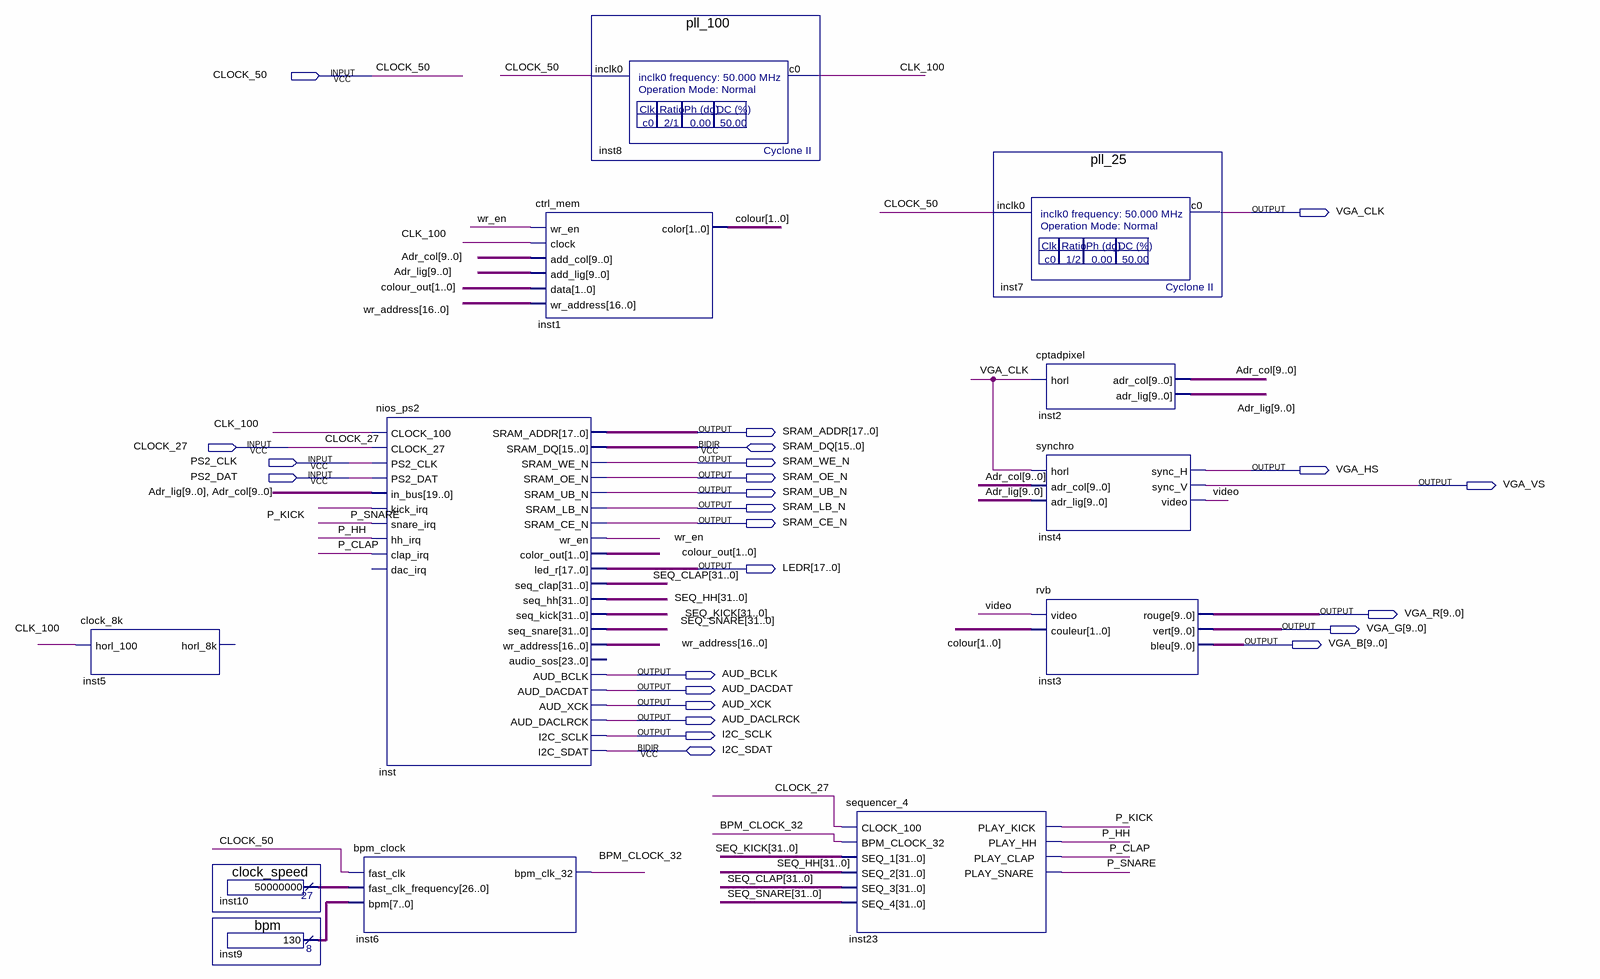
[diagram p0: schematic sheet]
// Quartus schematic main.bdf as structural Verilog: 12 symbols, 24 pins
module main (
  input  CLOCK_50,
  input  CLOCK_27,
  input  PS2_CLK,
  input  PS2_DAT,
  inout  [15:0] SRAM_DQ,
  inout  I2C_SDAT,
  output VGA_CLK,
  output [17:0] SRAM_ADDR,
  output SRAM_WE_N,
  output VGA_HS,
  output SRAM_OE_N,
  output VGA_VS,
  output SRAM_UB_N,
  output SRAM_LB_N,
  output SRAM_CE_N,
  output [17:0] LEDR,
  output [9:0] VGA_R,
  output [9:0] VGA_G,
  output [9:0] VGA_B,
  output AUD_BCLK,
  output AUD_DACDAT,
  output AUD_XCK,
  output AUD_DACLRCK,
  output I2C_SCLK
);

  wire BPM_CLOCK_32, CLK_100, P_CLAP, P_HH, P_KICK, P_SNARE, video, wr_en;
  wire [1:0] colour, colour_out;
  wire [7:0] inst9_result;
  wire [9:0] Adr_col, Adr_lig;
  wire [16:0] wr_address;
  wire [26:0] inst10_result;
  wire [31:0] SEQ_CLAP, SEQ_HH, SEQ_KICK, SEQ_SNARE;

  clock_8k inst5 (.horl_100(CLK_100));  // open: horl_8k
  clock_speed inst10 (.result(inst10_result));
  bpm inst9 (.result(inst9_result));
  nios_ps2 inst (
    .CLOCK_100(CLK_100), .CLOCK_27(CLOCK_27), .PS2_CLK(PS2_CLK), .PS2_DAT(PS2_DAT),
    .in_bus({Adr_lig, Adr_col}), .kick_irq(P_KICK), .snare_irq(P_SNARE), .hh_irq(P_HH), .clap_irq(P_CLAP),
    .SRAM_ADDR(SRAM_ADDR), .SRAM_WE_N(SRAM_WE_N), .SRAM_OE_N(SRAM_OE_N), .SRAM_UB_N(SRAM_UB_N),
    .SRAM_LB_N(SRAM_LB_N), .SRAM_CE_N(SRAM_CE_N), .wr_en(wr_en), .color_out(colour_out), .led_r(LEDR),
    .seq_clap(SEQ_CLAP), .seq_hh(SEQ_HH), .seq_kick(SEQ_KICK), .seq_snare(SEQ_SNARE),
    .wr_address(wr_address), .AUD_BCLK(AUD_BCLK), .AUD_DACDAT(AUD_DACDAT), .AUD_XCK(AUD_XCK),
    .AUD_DACLRCK(AUD_DACLRCK), .I2C_SCLK(I2C_SCLK), .SRAM_DQ(SRAM_DQ), .I2C_SDAT(I2C_SDAT));  // open: dac_irq, audio_sos
  bpm_clock inst6 (
    .fast_clk(CLOCK_50), .fast_clk_frequency(inst10_result), .bpm(inst9_result), .bpm_clk_32(BPM_CLOCK_32));
  ctrl_mem inst1 (
    .wr_en(wr_en), .clock(CLK_100), .add_col(Adr_col), .add_lig(Adr_lig), .data(colour_out),
    .wr_address(wr_address), .color(colour));
  pll_100 inst8 (.inclk0(CLOCK_50), .c0(CLK_100));
  sequencer_4 inst23 (
    .CLOCK_100(CLOCK_27), .BPM_CLOCK_32(BPM_CLOCK_32), .SEQ_1(SEQ_KICK), .SEQ_2(SEQ_HH), .SEQ_3(SEQ_CLAP),
    .SEQ_4(SEQ_SNARE), .PLAY_KICK(P_KICK), .PLAY_HH(P_HH), .PLAY_CLAP(P_CLAP), .PLAY_SNARE(P_SNARE));
  pll_25 inst7 (.inclk0(CLOCK_50), .c0(VGA_CLK));
  cptadpixel inst2 (.horl(VGA_CLK), .adr_col(Adr_col), .adr_lig(Adr_lig));
  synchro inst4 (.horl(VGA_CLK), .adr_col(Adr_col), .adr_lig(Adr_lig), .sync_H(VGA_HS), .sync_V(VGA_VS), .video(video));
  rvb inst3 (.video(video), .couleur(colour), .rouge(VGA_R), .vert(VGA_G), .bleu(VGA_B));
endmodule
